# EAGLE design Music Shield (EAGLE 5.10)
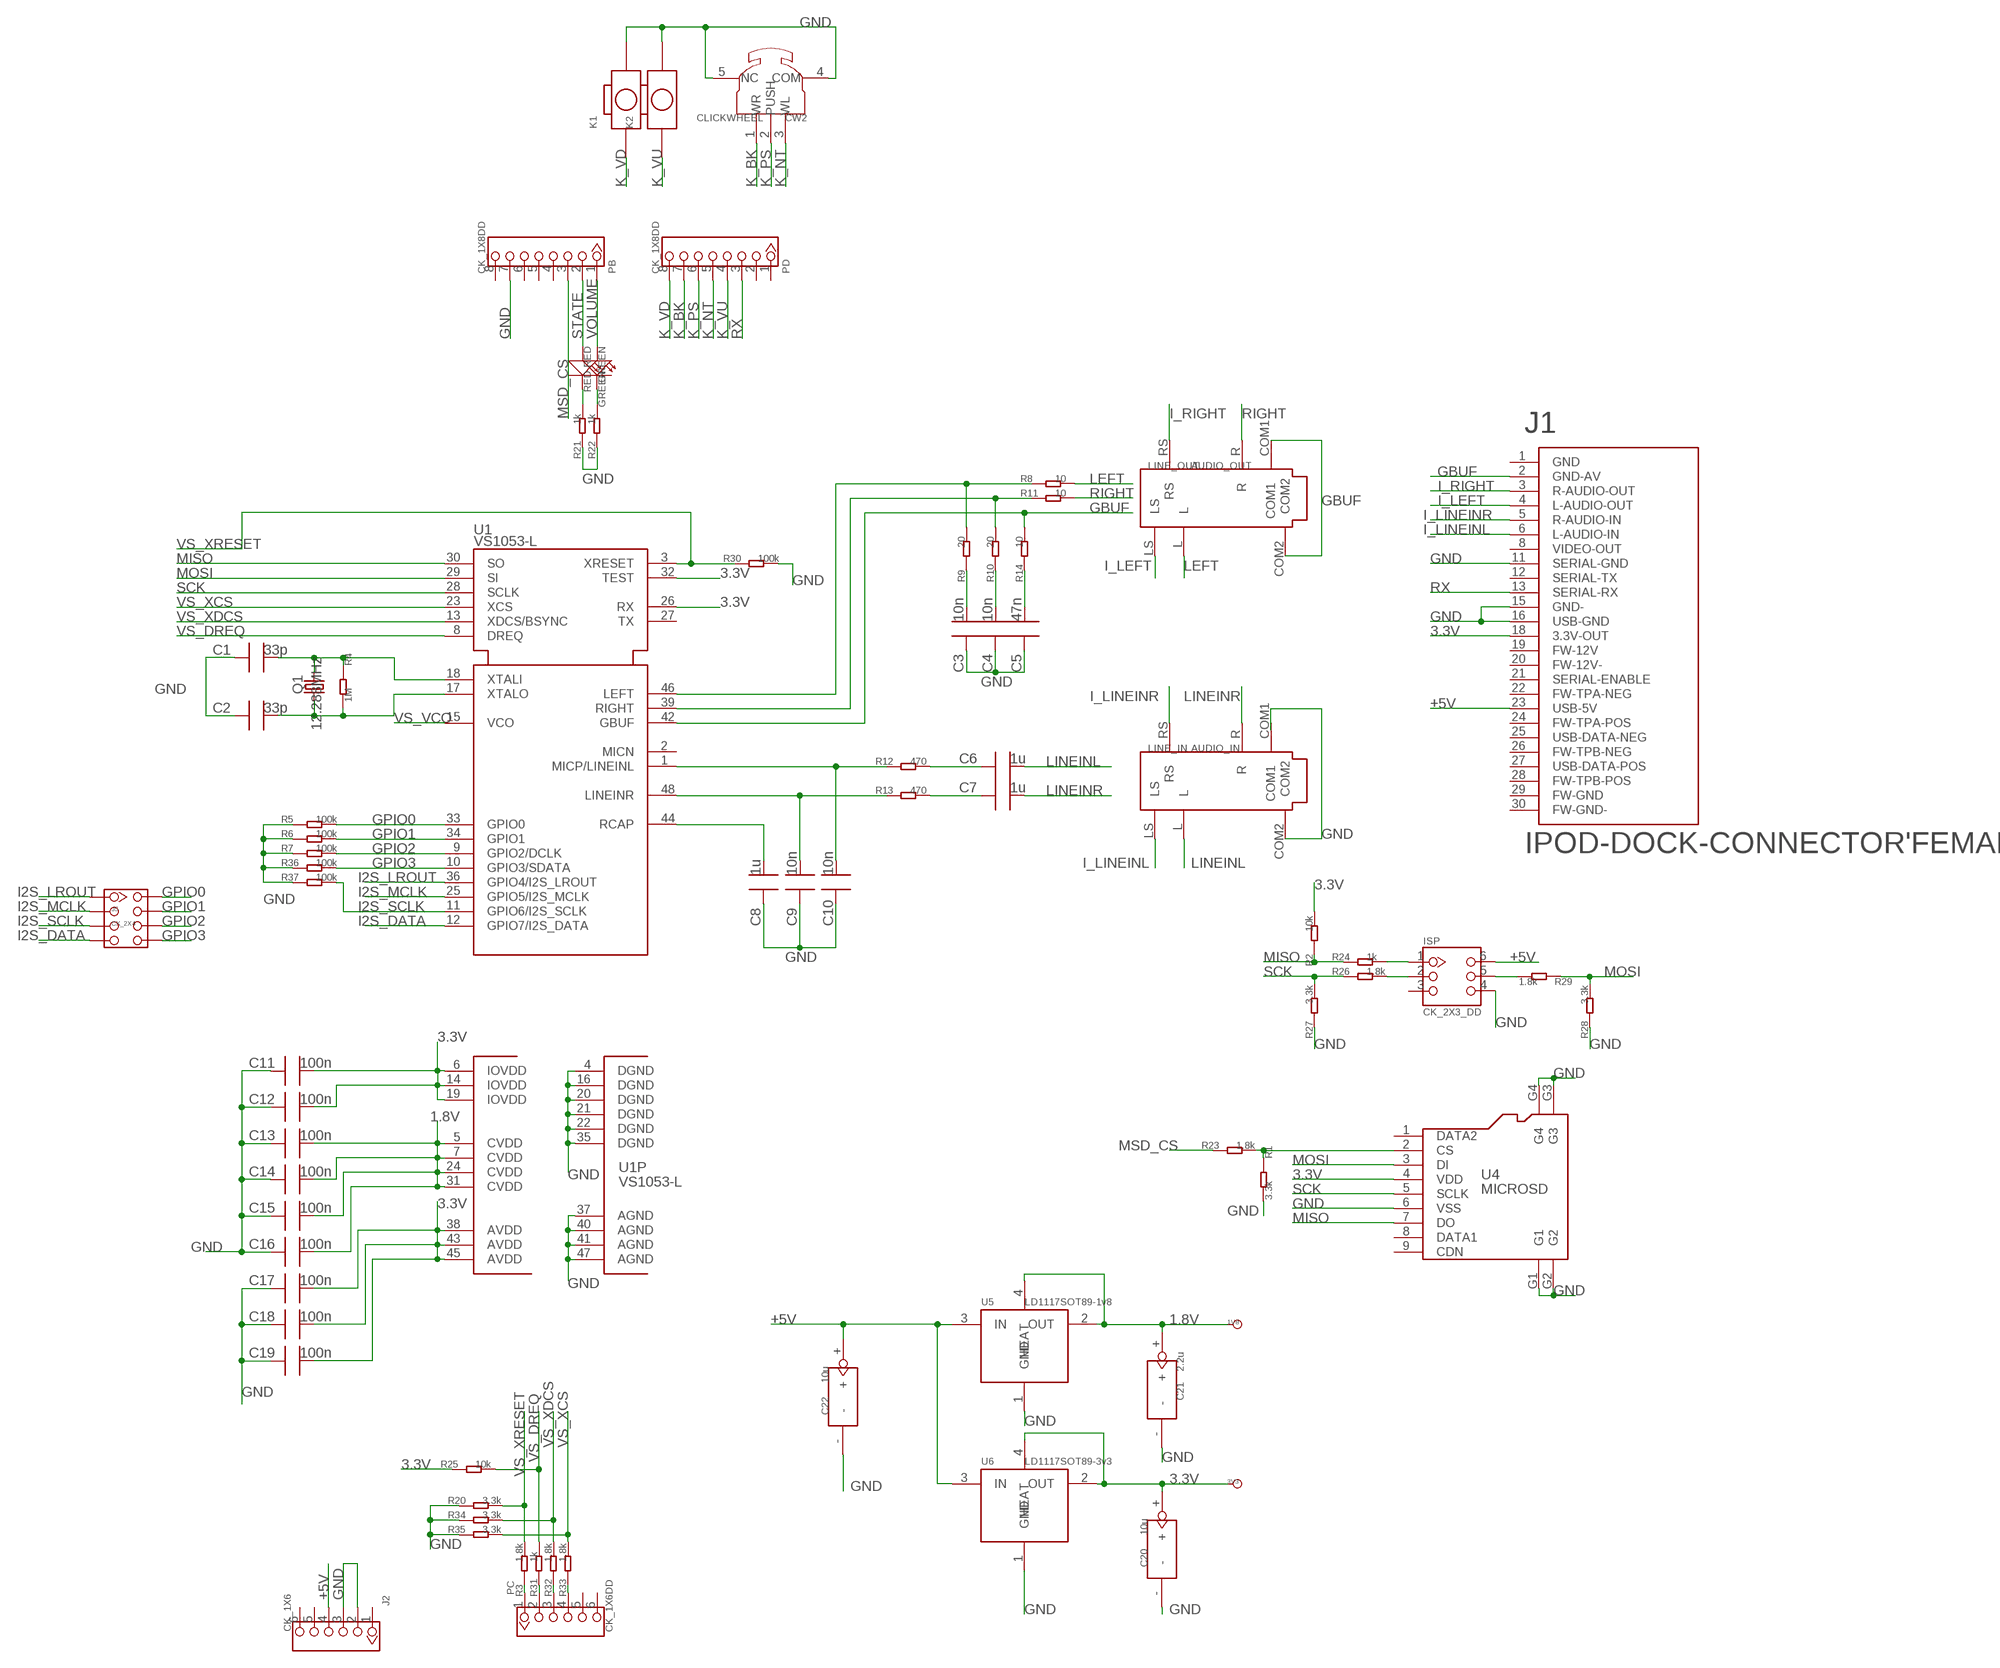
[diagram p0: schematic, sheet 1]

## Parts
1V8  TEST_POINT_SIZE_3030  [TP_3535]
3V3  TEST_POINT_SIZE_3030  [TP_3535]
C1  33p  C0603  [0603]
C2  33p  C0603  [0603]
C3  10n  C0603  [0603]
C4  10n  C0603  [0603]
C5  47n  C0603  [0603]
C6  1u  C0603  [0603]
C7  1u  C0603  [0603]
C8  1u  C0603  [0603]
C9  10n  C0603  [0603]
C10  10n  C0603  [0603]
C11  100n  C0603  [0603]
C12  100n  C0603  [0603]
C13  100n  C0603  [0603]
C14  100n  C0603  [0603]
C15  100n  C0603  [0603]
C16  100n  C0603  [0603]
C17  100n  C0603  [0603]
C18  100n  C0603  [0603]
C19  100n  C0603  [0603]
C20  10u  C_TAN_3X3.5  [C_TAN_3X3.5]
C21  2.2u  C_TAN_3X3.5  [C_TAN_3X3.5]
C22  10u  C_TAN_3X3.5  [C_TAN_3X3.5]
CW2  CLICKWHEEL  [CLICKWHEEL]
GREEN  GREEN  LED0603_DD  [LED0603]
ISP  CK_2X3_DD  [CK_2X3]
J1  IPOD-DOCK-CONNECTOR'FEMALE'  [IPOD_FEMALE_CONNECTOR]
J2  CK_1X6  [CK_1X6]
J5  CK_2X4  [CK_2X4]
K1  BOTTON_1_DP  [BTN_5.0_RST]
K2  BOTTON_1_DP  [BTN_5.0_RST]
LINE_IN  AUDIO_IN  AUDIO-SMD-6P  [6P-SMD-3.5]
LINE_OUT  AUDIO_OUT  AUDIO-SMD-6P  [6P-SMD-3.5]
PB  CK_1X8DD  [CK_1X8]
PC  CK_1X6DD  CK_1X6  [CK_1X6]
PD  CK_1X8DD  [CK_1X8]
Q1  12.288MHz  CRYSTALHC49UP  [HC49UP]
R1  3.3k  R0603  [0603]
R2  10k  R0603  [0603]
R3  1.8k  R0603  [0603]
R4  1M  R0603  [0603]
R5  100k  R0603  [0603]
R6  100k  R0603  [0603]
R7  100k  R0603  [0603]
R8  10  R0603  [0603]
R9  20  R0603  [0603]
R10  20  R0603  [0603]
R11  10  R0603  [0603]
R12  470  R0603  [0603]
R13  470  R0603  [0603]
R14  10  R0603  [0603]
R20  3.3k  R0603  [0603]
R21  1k  R0603  [0603]
R22  1k  R0603  [0603]
R23  1.8k  R0603  [0603]
R24  1k  R0603  [0603]
R25  10k  R0603  [0603]
R26  1.8k  R0603  [0603]
R27  3.3k  R0603  [0603]
R28  3.3k  R0603  [0603]
R29  1.8k  R0603  [0603]
R30  100k  R0603  [0603]
R31  1k  R0603  [0603]
R32  1.8k  R0603  [0603]
R33  1.8k  R0603  [0603]
R34  3.3k  R0603  [0603]
R35  3.3k  R0603  [0603]
R36  100k  R0603  [0603]
R37  100k  R0603  [0603]
RED  RED  LED0603_DD  [LED0603]
U1  VS1053-L  [LQFP48]
U4  MICROSD  [MICROSD]
U5  LD1117SOT89-1v8  LD1117SOT89  [SOT89]
U6  LD1117SOT89-3v3  LD1117SOT89  [SOT89]

## Nets
1.8V: 1V8.T C13.2 C14.2 C15.2 C16.2 C21.+ U1.5(CVDD) U1.7(CVDD) U1.24(CVDD) U1.31(CVDD) U5.2(OUT) U5.4(HEAT)
3.3V: 3V3.T C11.2 C12.2 C17.2 C18.2 C19.2 C20.+ J1.18(3.3V-OUT) R2.2 R25.1 U1.6(IOVDD) U1.14(IOVDD) U1.19(IOVDD) U1.26(RX) U1.32(TEST) U1.38(AVDD) U1.43(AVDD) U1.45(AVDD) U4.4(VDD) U6.2(OUT) U6.4(HEAT)
+5V: C22.+ ISP.6 J1.23(USB-5V) J2.4 U5.3(IN) U6.3(IN)
GBUF: J1.2(GND-AV) LINE_OUT.COM1 LINE_OUT.COM2 R14.2 U1.42(GBUF)
GND: C1.1 C2.1 C3.1 C4.1 C5.1 C8.1 C9.1 C10.1 C11.1 C12.1 C13.1 C14.1 C15.1 C16.1 C17.1 C18.1 C19.1 C20.- C21.- C22.- CW2.4(COM) CW2.5(NC) ISP.4 J1.11(SERIAL-GND) J1.15(GND-) J1.16(USB-GND) J2.2 J2.3 K1.P$2 K2.P$2 LINE_IN.COM2 PB.7 R1.2 R5.1 R6.1 R7.1 R20.1 R21.1 R22.1 R27.1 R28.1 R30.2 R34.1 R35.1 R36.1 R37.1 U1.4(DGND) U1.16(DGND) U1.20(DGND) U1.21(DGND) U1.22(DGND) U1.35(DGND) U1.37(AGND) U1.40(AGND) U1.41(AGND) U1.47(AGND) U4.6(VSS) U4.G1 U4.G2 U4.G3 U4.G4 U5.1(GND) U6.1(GND)
GPIO0: J5.8 R5.2 U1.33(GPIO0)
GPIO1: J5.7 R6.2 U1.34(GPIO1)
GPIO2: J5.6 R7.2 U1.9(GPIO2/DCLK)
GPIO3: J5.5 R36.2 U1.10(GPIO3/SDATA)
I2S_DATA: J5.4 U1.12(GPIO7/I2S_DATA)
I2S_LROUT: J5.1 U1.36(GPIO4/I2S_LROUT)
I2S_MCLK: J5.2 U1.25(GPIO5/I2S_MCLK)
I2S_SCLK: J5.3 R37.2 U1.11(GPIO6/I2S_SCLK)
I_LEFT: J1.4(L-AUDIO-OUT) LINE_OUT.LS
I_LINEINL: J1.6(L-AUDIO-IN) LINE_IN.LS
I_LINEINR: J1.5(R-AUDIO-IN) LINE_IN.RS
I_RIGHT: J1.3(R-AUDIO-OUT) LINE_OUT.RS
K_BK: CW2.1(WR) PD.7
K_NT: CW2.3(WL) PD.5
K_PS: CW2.2(PUSH) PD.6
K_VD: K1.P$1 PD.8
K_VU: K2.P$1 PD.4
LEFT: LINE_OUT.L R8.2
LINEINL: C6.2 LINE_IN.L
LINEINR: C7.2 LINE_IN.R
MISO: R2.1 R24.1 U1.30(SO) U4.7(DO)
MOSI: R28.2 R29.1 U1.29(SI) U4.3(DI)
MSD_CS: PB.3 R23.1
N$1: C1.2 Q1.2 R4.1 U1.18(XTALI)
N$2: C2.2 Q1.1 R4.2 U1.17(XTALO)
N$3: R21.2 RED.2(-)
N$4: GREEN.2(-) R22.2
N$5: R8.1 R9.2 U1.46(LEFT)
N$6: R10.2 R11.1 U1.39(RIGHT)
N$7: C10.2 R12.1 U1.1(MICP/LINEINL)
N$8: C3.2 R9.1
N$9: C4.2 R10.1
N$10: C5.2 R14.1
N$11: C9.2 R13.1 U1.48(LINEINR)
N$12: C8.2 U1.44(RCAP)
N$13: ISP.2 R26.2
N$14: C6.1 R12.2
N$15: C7.1 R13.2
N$16: ISP.1 R24.2
N$18: PC.1 R3.1
N$19: PC.2 R31.1
N$20: ISP.5 R29.2
N$21: R1.1 R23.2 U4.2(CS)
N$24: PC.3 R32.1
N$25: PC.4 R33.1
RIGHT: LINE_OUT.R R11.2
RX: J1.13(SERIAL-RX) PD.3
SCK: R26.1 R27.2 U1.28(SCLK) U4.5(SCLK)
STATE: PB.2 RED.1(+)
VOLUME: GREEN.1(+) PB.1
VS_DREQ: R25.2 R31.2 U1.8(DREQ)
VS_VCO: U1.15(VCO)
VS_XCS: R33.2 R35.2 U1.23(XCS)
VS_XDCS: R32.2 R34.2 U1.13(XDCS/BSYNC)
VS_XRESET: R3.2 R20.2 R30.1 U1.3(XRESET)
Unconnected: ISP.3 J1.1(GND) J1.8(VIDEO-OUT) J1.12(SERIAL-TX) J1.19(FW-12V) J1.20(FW-12V-) J1.21(SERIAL-ENABLE) J1.22(FW-TPA-NEG) J1.24(FW-TPA-POS) J1.25(USB-DATA-NEG) J1.26(FW-TPB-NEG) J1.27(USB-DATA-POS) J1.28(FW-TPB-POS) J1.29(FW-GND) J1.30(FW-GND-) J2.1 J2.5 J2.6 LINE_IN.COM1 PB.4 PB.5 PB.6 PB.8 PC.5 PC.6 PD.1 PD.2 U1.2(MICN) U1.27(TX) U4.1(DATA2) U4.8(DATA1) U4.9(CDN)

## Library data of the parts
1V8 3V3 = For_Test_Albert:TEST_POINT
C1-C19 = CPT_SMD:C0603; C0603: 100N
C20-C22 = CPT_SMD:C_TAN
CW2 = MusicShield:CLICKWHEEL
GREEN RED = CPT_SMD:LED0603
ISP = CONNECTER:CK_2X3
J1 = CONNECTER:IPOD-DOCK-CONNECTOR
J2 PC = CONNECTER:CK_1X6
J5 = CONNECTER:CK_2X4
K1 K2 = CPT_SMD:BOTTON_1
LINE_IN LINE_OUT = Connector:AUDIO-SMD-6P
PB PD = CONNECTER:CK_1X8
Q1 = crystal:CRYSTAL: CRYSTAL
R1-R14 R20-R37 = CPT_SMD:R0603
U1 = vlsi:VS1053
U4 = CONNECTER:MICROSD
U5 U6 = ICs_v54:LD1117

## Net classes
0 default: width 0.152 mm, drill 0.305 mm, clearance 0.152 mm

## Board
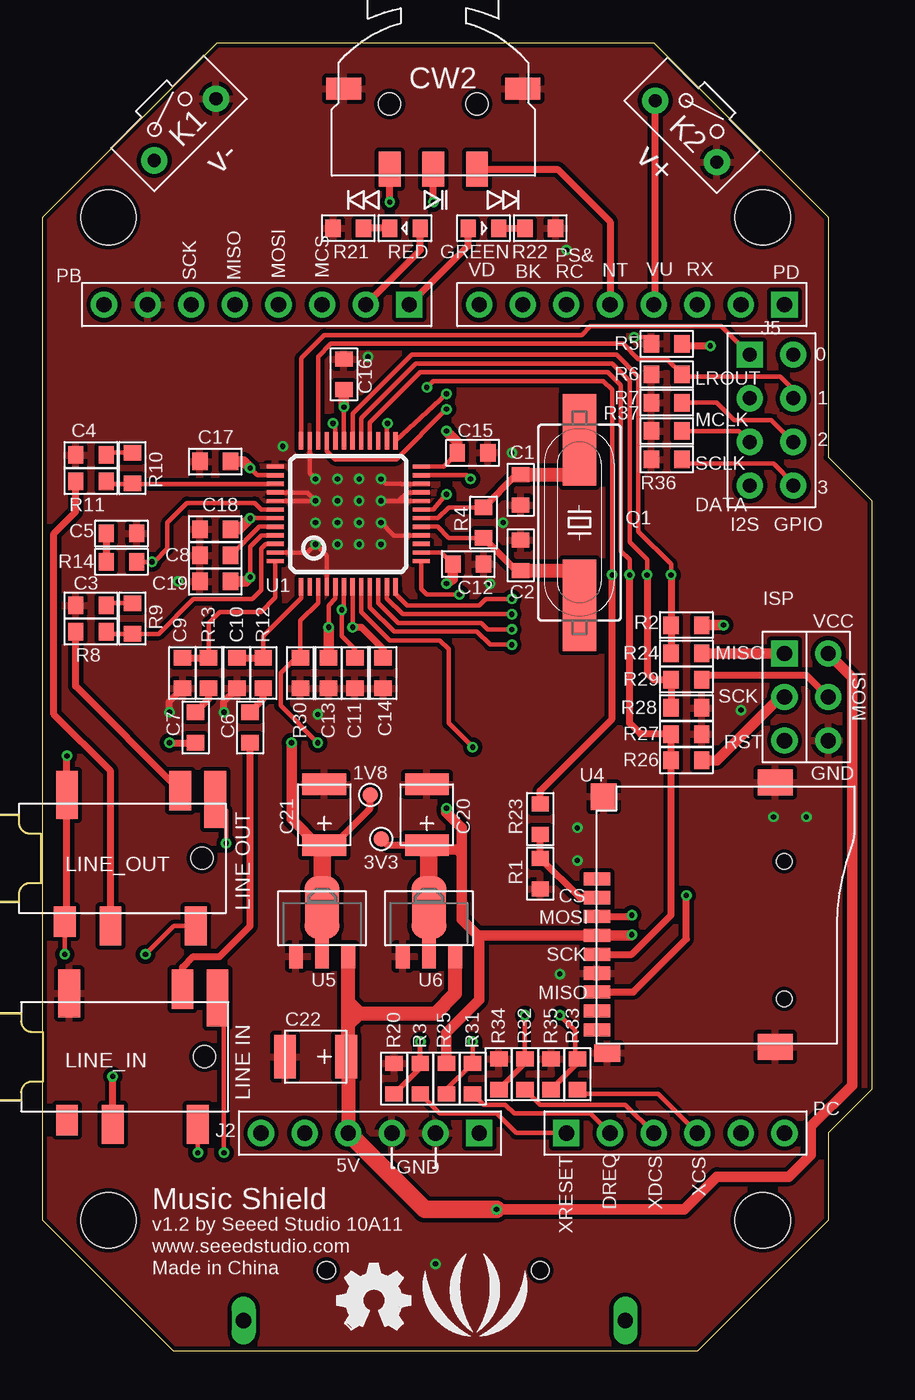
[diagram p1: board, top side]
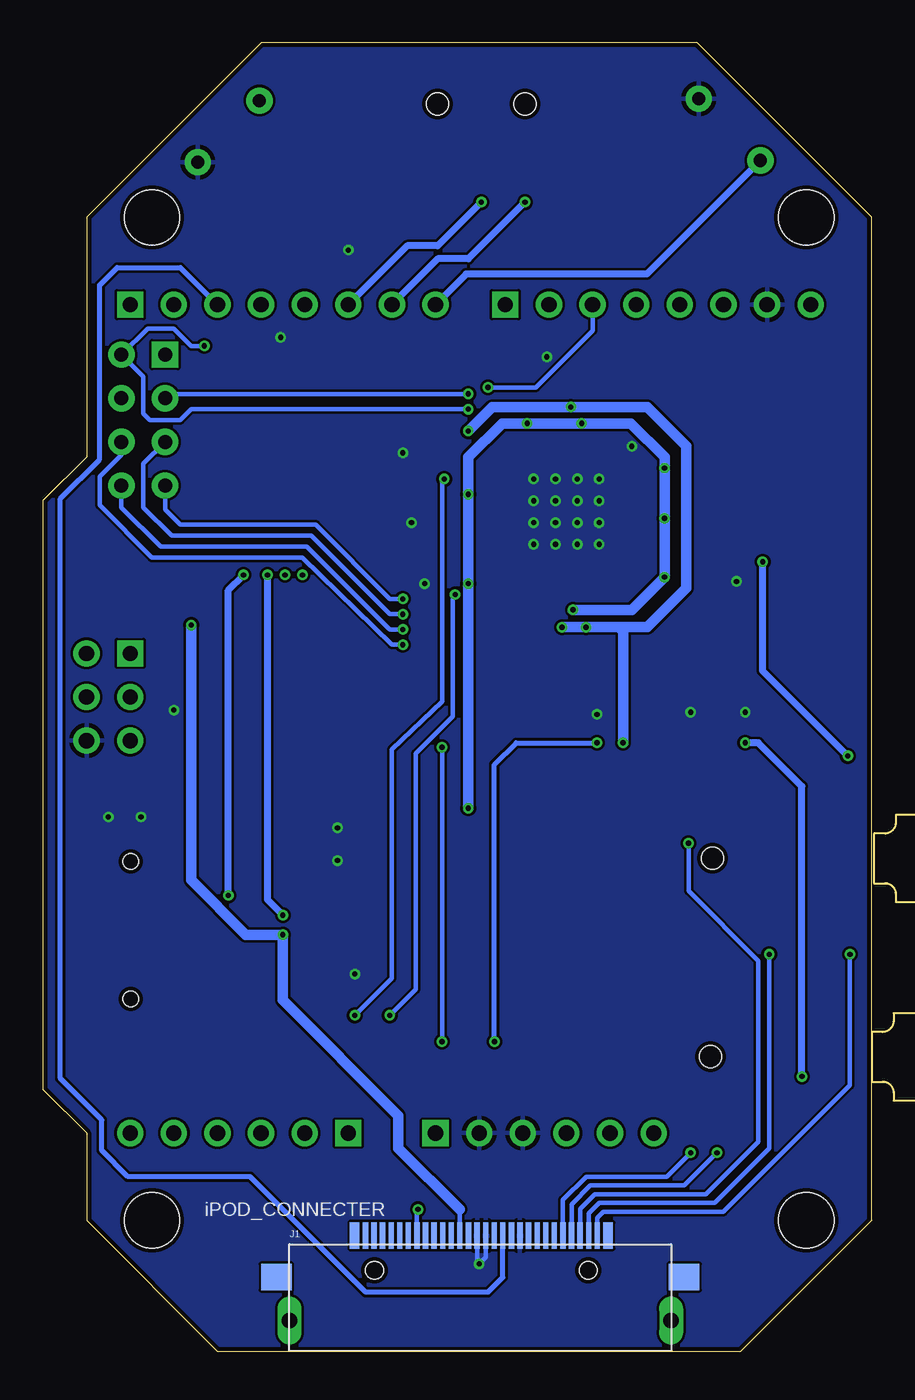
[diagram p2: board, bottom side, seen from below]

Size 48.26 x 76.2 mm. Coordinates in mm from the lower left corner, seen from the top.
Outline: 45.72,66.04 45.72,52.07 48.26,49.53 48.26,15.24 45.72,12.7 45.72,7.62 38.1,0 7.62,0 0,7.62 0,66.04 10.16,76.2 35.56,76.2 45.72,66.04
Copper layers (1*16): Top 0.035mm / dielectric 1.5mm / Bottom 0.035mm
Design rules "SeeedStudio_rule_no_angle_090911": minimum track width 6mil, minimum drill 12mil, track to track 6mil, track to pad 6mil, pad to pad 6mil, via to via 6mil, smd to smd 0mil, copper to edge 10mil, drill to drill 10mil, minimum pad ring 10mil, minimum via ring 6mil, stop-mask expansion 2mil, vias tented up to drill 100mil, thermal gap 10mil
Holes 3.2 mm at 41.91,66.04 3.81,66.04 41.91,7.62 3.81,7.62
tRestrict: area 13.2,49.7 to 13.8,49.8; area 21.7,50.2 to 22.4,50.3; area 21.7,49.7 to 22.4,49.8
bRestrict: area 22.7,6.5 to 22.8,6.9; area 20.1,7.5 to 20.8,7.6; area 22.2,7.5 to 23.2,7.6

### Footprints (pad centres in the part's own frame; a part is rotated, then mirrored left to right if it is on the bottom)
TP_3535 = smd 0.889 x 0.889: T 0,0
0603 = smd 0.889 x 1.016: 1 -0.889,0; 2 0.889,0
C_TAN_3X3.5 = smd 2.54 x 1.27: + 0,1.778; - 0,-1.778
CLICKWHEEL = smd 1.27 x 2.032: 1 2.54,-0.381; 2 0,-0.381; 3 -2.54,-0.381 | smd 2.032 x 1.27: 4 -5.207,-5.08; 5 5.207,-5.08 | hole 1.27: -2.54,-4.191; 2.54,-4.191
LED0603 = smd 0.889 x 1.016: 1 -0.889,0; 2 0.889,0
CK_2X3 = drill 0.889 pad 1.524 square: 1 -1.27,2.54 | drill 0.889 pad 1.524 round: 2 -1.27,0; 3 -1.27,-2.54; 4 1.27,-2.54; 5 1.27,0; 6 1.27,2.54
IPOD_FEMALE_CONNECTOR = smd 1.524 x 0.559: 1 -0.508,7.377; 30 -0.508,-7.377 | smd 1.524 x 0.305: 2 -0.508,6.75; 3 -0.508,6.25; 4 -0.508,5.75; 5 -0.508,5.25; 6 -0.508,4.75; 7 -0.508,4.25; 8 -0.508,3.75; 9 -0.508,3.25; 10 -0.508,2.75; 11 -0.508,2.25; 12 -0.508,1.75; 13 -0.508,1.25; 14 -0.508,0.75; 15 -0.508,0.25; 16 -0.508,-0.25; 17 -0.508,-0.75; 18 -0.508,-1.25; 19 -0.508,-1.75; 20 -0.508,-2.25; 21 -0.508,-2.75; 22 -0.508,-3.25; 23 -0.508,-3.75; 24 -0.508,-4.25; 25 -0.508,-4.75; 26 -0.508,-5.25; 27 -0.508,-5.75; 28 -0.508,-6.25; 29 -0.508,-6.75 | smd 1.524 x 1.778: S1 1.905,11.811; S2 1.905,-11.938 | drill 0.889 long: S3 4.445,-11.176; S4 4.445,11.049 | hole 1.016: 1.524,6.223; 1.524,-6.223
CK_1X6 = drill 0.889 pad 1.524 square: 1 0,6.35 | drill 0.889 pad 1.524 round: 2 0,3.81; 3 0,1.27; 4 0,-1.27; 5 0,-3.81; 6 0,-6.35
CK_2X4 = drill 0.813 pad 1.524 square: 1 -1.27,3.81 | drill 0.813 pad 1.524 round: 2 -1.27,1.27; 3 -1.27,-1.27; 4 -1.27,-3.81; 5 1.27,-3.81; 6 1.27,-1.27; 7 1.27,1.27; 8 1.27,3.81
BTN_5.0_RST = drill 0.762 pad 1.524 round: P$1 0,2.54; P$2 0,-2.54
6P-SMD-3.5 = smd 1.27 x 1.778: COM1 -4.572,3.683 | smd 1.27 x 2.794: COM2 -4.699,-3.683 | smd 1.27 x 2.286: L -11.303,-3.937; R -7.239,3.937; RS -12.192,3.937 | smd 1.27 x 3.302: LS -13.335,-3.429 | hole 1.27: -12.573,0
CK_1X8@1 = drill 0.889 pad 1.524 square: 1 0,8.89 | drill 0.889 pad 1.524 round: 2 0,6.35; 3 0,3.81; 4 0,1.27; 5 0,-1.27; 6 0,-3.81; 7 0,-6.35; 8 0,-8.89
HC49UP = smd 5.334 x 1.93: 1 -4.826,0; 2 4.826,0
LQFP48 = smd 0.25 x 1: 1 -2.75,-4.25; 2 -2.25,-4.25; 3 -1.75,-4.25; 4 -1.25,-4.25; 5 -0.75,-4.25; 6 -0.25,-4.25; 7 0.25,-4.25; 8 0.75,-4.25; 9 1.25,-4.25; 10 1.75,-4.25; 11 2.25,-4.25; 12 2.75,-4.25; 25 2.75,4.25; 26 2.25,4.25; 27 1.75,4.25; 28 1.25,4.25; 29 0.75,4.25; 30 0.25,4.25; 31 -0.25,4.25; 32 -0.75,4.25; 33 -1.25,4.25; 34 -1.75,4.25; 35 -2.25,4.25; 36 -2.75,4.25 | smd 1 x 0.25: 13 4.25,-2.75; 14 4.25,-2.25; 15 4.25,-1.75; 16 4.25,-1.25; 17 4.25,-0.75; 18 4.25,-0.25; 19 4.25,0.25; 20 4.25,0.75; 21 4.25,1.25; 22 4.25,1.75; 23 4.25,2.25; 24 4.25,2.75; 37 -4.25,2.75; 38 -4.25,2.25; 39 -4.25,1.75; 40 -4.25,1.25; 41 -4.25,0.75; 42 -4.25,0.25; 43 -4.25,-0.25; 44 -4.25,-0.75; 45 -4.25,-1.25; 46 -4.25,-1.75; 47 -4.25,-2.25; 48 -4.25,-2.75
MICROSD = smd 1.524 x 0.762: 1 0,4.4; 2 0,3.3; 3 0,2.2; 4 0,1.1; 5 0,0; 6 0,-1.1; 7 0,-2.2; 8 0,-3.3; 9 0,-4.4 | smd 1.524 x 1.016: G1 0.6,-5.746 | smd 2.032 x 1.524: G2 10.373,-5.4; G3 10.373,10 | smd 1.524 x 1.524: G4 0.392,9.181 | hole 0.889: 10.9,-2.6; 10.9,5.4
SOT89 = smd 0.8 x 1.4: 1 -1.524,-1.905; 3 1.524,-1.905 | smd 0.8 x 1.9: 2 0,-1.651 | smd 2.032 x 3.65: 4 0,0.94

### Placement (x,y rotation side)
1V8  19.05,32.39 90 top
3V3  19.68,29.84 0 top
C1  27.81,50.17 90 top
C2  27.81,46.36 270 top
C3  2.79,43.43 0 top
C4  2.79,52.2 0 top
C5  4.57,47.62 180 top
C6  12.06,36.32 270 top
C7  8.89,36.32 270 top
C8  10.03,46.36 0 top
C9  8.13,39.5 90 top
C10  11.3,39.5 90 top
C11  18.16,39.5 90 top
C12  24.77,45.85 180 top
C13  16.64,39.5 90 top
C14  19.81,39.5 90 top
C15  25.02,52.32 180 top
C16  17.53,56.9 270 top
C17  10.03,51.82 0 top
C18  10.03,47.88 0 top
C19  10.03,44.83 0 top
C20  22.35,31.24 180 top
C21  16.38,31.24 180 top
C22  15.88,17.14 270 top
CW2  22.73,68.45 180 top
GREEN  25.65,65.41 0 top
ISP  44.45,38.1 0 top
J1  22.73,6.22 270 bottom
J2  19.05,12.7 270 top
J5  42.42,54.23 0 top
K1  8.28,71.15 135 top
K2  37.45,71.04 45 top
LINE_IN  -3.17,17.14 180 top
LINE_OUT  -3.3,28.7 180 top
PB  CK_1X8DD  [CK_1X8@1]  12.45,60.96 270 top
PC  36.83,12.7 90 top
PD  CK_1X8DD  [CK_1X8@1]  34.29,60.96 270 top
Q1  31.24,48.26 90 top
R1  28.96,27.81 270 top
R2  37.47,42.29 0 top
R3  21.97,15.88 90 top
R4  25.65,48.26 270 top
R5  36.32,58.67 0 top
R6  36.32,56.9 0 top
R7  36.32,55.25 0 top
R8  2.79,41.91 180 top
R9  5.21,42.67 270 top
R10  5.21,51.44 270 top
R11  2.79,50.67 180 top
R12  12.83,39.5 270 top
R13  9.65,39.5 270 top
R14  4.57,45.97 0 top
R20  20.45,15.88 270 top
R21  17.78,65.41 0 top
R22  28.96,65.41 180 top
R23  28.96,30.99 270 top
R24  37.47,40.64 0 top
R25  23.5,15.88 270 top
R26  37.47,34.42 0 top
R27  37.47,35.94 180 top
R28  37.47,37.47 180 top
R29  37.47,39.12 0 top
R30  14.99,39.5 270 top
R31  25.02,15.88 90 top
R32  28.07,16.13 90 top
R33  31.11,16.13 90 top
R34  26.54,16.13 270 top
R35  29.59,16.13 270 top
R36  36.32,51.94 0 top
R37  36.32,53.59 0 top
RED  21.08,65.41 180 top
U1  17.78,48.77 0 top
U4  32.26,23.11 0 top
U5  16.26,24.89 0 top
U6  22.48,24.89 0 top
U$1  [LOGO_SILK]  25.15,2.54 0 top
U$3  [OSHW_FILLX150_NOTEXT]  17.14,1.27 0 top

### Tracks (layer width: path | path; a pad name or v marks a point on that pad's centre or on a via)
1.8V  (via drill 0.3)
  Top 0.254: v17.53,54.99 U1.31 | U1.5 17.03,43.83 16.64,43.43 v16.64,42.16 | U1.7 18.03,43.18 18.03,42.93 v18.03,42.16 | U1.24 23.32,51.52 C15.2
  Top 0.406: v18.03,42.16 18.54,42.16 19.81,40.89 C14.2 | 1V8.T 19.05,31.62 16.89,29.46 C21.+
  Top 0.61: v16.64,42.16 C13.2 | C15.2 24.13,52.96 v23.5,53.59 | 16,29.46 14.48,30.99 v14.48,35.43 | C16.2 v17.53,54.99
  Top 0.813: U5.2 U5.4
  Top 1.016: U5.4 16.26,29.34 | 16.26,29.34 C21.+ | 16.26,29.34 16.13,29.34 16,29.46
  Bottom 0.61: v23.5,53.59 22.1,54.99 v17.53,54.99 13.08,54.99 10.79,52.7 10.79,44.45 13.08,42.16 14.73,42.16 | 14.73,42.16 v16.64,42.16 v18.03,42.16 | v14.48,35.43 14.48,41.91 14.73,42.16
3.3V  (via drill 0.3)
  Top 0.254: U1.26 20.03,54 v20.07,54.04 | U1.38 12.48,51.02 v12.06,51.44 | U1.43 12.44,48.52 v12.06,48.51 | U1.32 17.03,53.9 v16.89,54.04 | U1.45 12.72,47.52 12.06,46.86 v12.06,45.08 | U1.19 22.73,49.02 v23.5,49.91 | U1.14 23.2,46.52 C12.2 | U1.6 17.53,43.44 v17.4,43.18 17.4,41.66 18.16,40.89 C11.2
  Top 0.406: C20.+ 20.07,29.46 3V3.T
  Top 0.61: C19.2 11.81,44.83 v12.06,45.08 | C18.2 11.43,47.88 v12.06,48.51 | C17.2 11.68,51.82 v12.06,51.44 | C12.2 23.88,44.96 v23.5,44.7 | v39.62,42.29 R2.2 | v34.29,24.26 34.25,24.21 U4.4 25.48,24.21 25.4,24.13 | 22.48,29.21 24.13,29.21 24.38,28.96 | R25.1 23.5,18.54 25.4,20.45 25.4,24.13 | 25.4,24.13 24.38,25.15 24.38,28.96 | v23.5,31.62 23.5,31.37 24.38,30.48 24.38,28.96
  Top 0.813: U6.4 U6.2
  Top 1.016: U6.4 22.48,29.21 22.48,29.34 C20.+
  Bottom 0.254: J1.18 23.98,8.23 24,8.26
  Bottom 0.61: v17.4,43.18 13.97,43.18 v12.06,45.08 v12.06,48.51 v12.06,51.44 12.06,52.07 14.04,54.04 v16.89,54.04 v20.07,54.04 21.52,54.04 23.5,52.07 v23.5,49.91 v23.5,44.7 v23.5,31.62 | v39.62,42.29 39.62,27.43 36.45,24.26 v34.29,24.26 34.29,20.45 27.56,13.72 27.56,11.81 24,8.26
+5V  (via drill 0.3)
  Top 0.61: ISP.6 47.12,39.24 47.12,15.49 44.7,13.08 44.7,11.43 43.43,10.16 39.24,10.16 37.34,8.26 v26.42,8.26
  Top 0.813: J2.4 17.78,17.02 C22.+ 17.78,17.27 17.78,19.05 | 17.78,19.05 17.78,20.32 | 17.78,20.32 U5.3 | U6.3 24,20.83 22.86,19.69 18.41,19.69 | 17.78,20.32 18.41,19.69 | 17.78,19.05 18.41,19.69
  Top 1.016: v26.42,8.26 22.23,8.26 J2.4
  Bottom 0.254: J1.23 26.48,8.19 v26.42,8.26
GBUF  (via drill 0.3)
  Top 0.254: v6.35,45.97 R14.2 v6.35,45.97 | v6.35,45.97 6.48,45.97 7.24,46.74 7.24,48.26 8.38,49.4 12.32,49.4 12.7,49.02 U1.42 | v1.27,23.11 LINE_OUT.COM1
  Top 0.406: v1.4,34.67 LINE_OUT.COM2 1.4,25.15 LINE_OUT.COM1
  Bottom 0.254: J1.2 15.98,7.77 15.62,8.13 8.64,8.13 1.27,15.49 v1.27,23.11
  Bottom 0.406: v6.35,45.97 6.35,39.62 v1.4,34.67
GND  (via drill 0.3)
  Top 0.254: U1.47 15.4,46.52 v15.88,46.99 16.53,46.33 U1.4 | 20.7,49.52 19.7,49.52 v19.68,49.53 | 20.7,49.52 U1.20 | U1.21 21.2,50.02 20.7,49.52 | U1.22 20.86,50.52 20.83,50.55 19.94,50.55 v19.68,50.8 | U1.16 20.43,47.52 v19.68,48.26 | U1.41 15.86,49.52 v15.88,49.53 15.39,50.02 U1.40 | U1.35 15.53,51.14 v15.88,50.8 | v34.42,59.06 35.05,59.06 R5.1
  Top 0.406: v7.37,37.21 7.37,37.85 C9.1 | v10.54,37.21 10.54,37.85 C10.1
  Bottom 0.254: J1.15 22.48,5.46 v22.86,5.08 22.98,5.2 J1.16
  other vias: 13.97,52.7 17.14,50.8 18.41,50.8 19.68,46.99 18.41,46.99 17.14,46.99 15.88,48.26 17.14,49.53 18.41,49.53 18.41,48.26 17.14,48.26 44.45,31.11 30.1,21.97 7.87,44.83 26.04,44.7 26.8,48.26 27.3,52.32 18.92,57.91 40.64,37.34 16,37.08 30.48,64.14 31.11,30.48 31.11,28.57 42.55,31.11
  pour Top: -8.89,60.96 -6.35,60.96 -6.35,58.42 -8.89,58.42
  pour Top (isolate 0.254): 0,66.04 10.16,76.2 35.56,76.2 45.72,66.04 45.72,52.07 48.26,49.53 48.26,15.24 45.72,12.7 45.72,7.62 38.1,0 7.62,0 0,7.62
  pour Bottom: 0,66.04 10.16,76.2 35.56,76.2 45.72,66.04 45.72,52.07 48.26,49.53 48.39,15.24 45.72,12.7 45.72,7.62 38.1,0 7.62,0 0,7.62
GPIO0  (via drill 0.3)
  Top 0.254: U1.33 16.53,52.43 17.02,51.94 20.57,51.94 v23.5,54.86
  Top 0.406: v38.86,58.55 37.21,58.55 R5.2
  Bottom 0.254: v23.5,54.86 39.62,54.86 40.26,54.23 42.04,54.23 42.42,54.61 42.42,56.77 J5.8 42.16,59.56 40.64,59.56 39.62,58.55 v38.86,58.55
GPIO1
  Top 0.254: U1.34 16.03,57.94 16.76,58.67 33.78,58.67 34.67,57.78 36.32,57.78 R6.2 37.34,56.77 42.93,56.77 43.69,56.01 J5.7
GPIO2  (via drill 0.3)
  Top 0.254: U1.9 19.03,43.33 20.45,41.91 25.27,41.91 26.04,41.15 v27.3,41.15 | R7.2 39.24,55.25 40.26,54.23 42.42,54.23 J5.6
  Bottom 0.254: v27.3,41.15 27.94,41.15 33.15,46.23 41.91,46.23 44.96,49.28 44.96,50.93 43.69,52.2 J5.6
GPIO3  (via drill 0.3)
  Top 0.254: U1.10 19.53,43.59 20.7,42.42 25.53,42.42 25.91,42.04 v27.3,42.04 | J5.5 43.69,50.55 42.55,51.69 37.47,51.69 R36.2
  Bottom 0.254: v27.3,42.04 28.07,42.04 32.89,46.86 41.4,46.86 43.69,49.15 J5.5
I2S_DATA  (via drill 0.3)
  Top 0.254: U1.12 20.53,44.11 21.21,43.43 25.4,43.43 25.78,43.81 v27.3,43.81
  Bottom 0.254: v27.3,43.81 28.07,43.81 32.38,48.13 40.26,48.13 41.15,49.02 J5.4
I2S_LROUT
  Top 0.254: U1.36 15.03,57.83 16.38,59.18 31.37,59.18 31.88,59.69 39.5,59.69 J5.1
I2S_MCLK  (via drill 0.3)
  Top 0.254: U1.25 20.53,53.04 v23.5,55.75
  Bottom 0.254: v23.5,55.75 40.89,55.75 J5.2
I2S_SCLK  (via drill 0.3)
  Top 0.254: U1.11 20.03,43.85 20.95,42.93 v27.3,42.93 | R37.2 40.51,53.59 J5.3
  Bottom 0.254: v27.3,42.93 28.07,42.93 32.64,47.5 40.77,47.5 42.42,49.15 42.42,51.69 J5.3
I_LEFT  (via drill 0.3)
  Top 0.254: v10.67,29.59 10.67,31.5 LINE_OUT.LS
  Bottom 0.254: J1.4 16.98,8.29 16.13,9.14 9.65,9.14 6.6,12.19 6.6,22.73 10.67,26.8 v10.67,29.59
I_LINEINL  (via drill 0.3)
  Top 0.254: 10.41,20.32 LINE_IN.LS 10.54,20.19 v10.54,11.56
  Bottom 0.254: J1.6 17.98,8.81 16.64,10.16 11.94,10.16 v10.54,11.56
I_LINEINR  (via drill 0.3)
  Top 0.254: v9.02,11.56 LINE_IN.RS
  Bottom 0.254: J1.5 17.48,8.55 16.38,9.65 10.92,9.65 v9.02,11.56
I_RIGHT  (via drill 0.3)
  Top 0.254: v5.97,23.11 7.62,24.77 LINE_OUT.RS
  Bottom 0.254: J1.3 16.48,8.03 15.88,8.64 9.14,8.64 5.97,11.81 v5.97,23.11
K_BK  (via drill 0.3)
  Top 0.406: v20.19,66.93 CW2.1
  Bottom 0.406: PD.7 25.27,63.63 23.5,63.63 v20.19,66.93
K_NT
  Top 0.406: PD.5 33.02,65.79 29.97,68.83 CW2.3
K_PS  (via drill 0.3)
  Top 0.406: v22.73,66.93 CW2.2
  Bottom 0.406: PD.6 27.05,64.39 25.27,64.39 v22.73,66.93
K_VD
  Bottom 0.406: PD.8 23.62,62.74 13.1,62.74 K1.P$1
K_VU
  Top 0.406: K2.P$1 35.65,61.05 PD.4
LEFT
  Top 0.406: R8.2 1.91,38.73 LINE_OUT.L
LINEINL
  Top 0.406: C6.2 12.06,24.77 10.29,22.99 8.76,22.99 8.13,22.35 LINE_IN.L
LINEINR  (via drill 0.3)
  Top 0.406: v7.37,35.43 C7.2 | LINE_IN.R v4.06,16
  Bottom 0.406: v7.37,35.43 6.6,35.43 4.06,32.89 v4.06,16
MISO  (via drill 0.3)
  Top 0.254: U1.30 18.03,54.61 21.46,58.04 33.4,58.04 34.67,56.77 34.67,47.75 36.58,45.85 v36.58,45.21
  Top 0.406: R24.1 R2.1 v36.58,45.21 | U4.7 34.38,20.91 37.47,24 v37.47,26.54
  Bottom 0.406: v37.47,26.54 37.47,44.32 v36.58,45.21
MOSI  (via drill 0.3)
  Top 0.254: U1.29 18.53,54.34 21.72,57.53 33.15,57.53 34.16,56.52 34.16,47.12 35.18,46.1 v35.18,45.21
  Top 0.406: R28.2 R29.1 35.56,39.12 35.18,39.5 v35.18,45.21 | U4.3 34.2,25.31 v34.29,25.4
  Bottom 0.406: v34.29,25.4 35.18,26.29 v35.18,45.21
MSD_CS  (via drill 0.3)
  Top 0.254: v33.15,45.21 33.15,56.01 32.64,56.52 22.73,56.52 v22.35,56.13
  Top 0.406: v33.15,45.21 33.15,36.83 28.96,32.64 R23.1
  Bottom 0.254: v22.35,56.13 19.56,56.13 16.26,59.44 PB.3
N$1
  Top 0.254: R4.1 23.62,49.15 22.99,48.52 U1.18
  Top 0.305: 30.73,51.05 31.11,51.44 31.11,52.96 Q1.2
  Top 0.406: C1.2 27.56,51.05 R4.1
  Top 0.813: C1.2 30.73,51.05
N$2
  Top 0.254: R4.2 23.62,47.37 22.98,48.02 U1.17
  Top 0.406: C2.2 27.56,45.47 R4.2
  Top 0.813: C2.2 30.73,45.47 30.73,43.94 Q1.1
N$3
  Top 0.406: RED.2 R21.2
N$4
  Top 0.406: GREEN.2 R22.2
N$5
  Top 0.254: U1.46 12.98,47.02 12.7,46.74 12.7,44.32 12.19,43.81 8.76,43.81 6.73,41.78 R9.2 3.81,41.78 R8.1
N$6
  Top 0.254: 5.18,50.52 U1.39 | 5.18,50.52 R10.2 | 5.18,50.52 3.84,50.52 R11.1
N$7
  Top 0.254: U1.1 15.03,43.86 12.83,41.66 R12.1
  Top 0.406: C10.2 R12.1
N$8
  Top 0.254: R9.1 3.81,43.56 C3.2
N$9
  Top 0.254: R10.1 3.81,52.32 C4.2
N$10
  Top 0.406: C5.2 R14.1
N$11
  Top 0.254: U1.48 13.53,43.88 12.7,43.05 10.29,43.05 9.65,42.42 R13.1
  Top 0.406: C9.2 R13.1
N$12
  Top 0.254: U1.44 12.59,48.02 C8.2
N$13
  Top 0.61: ISP.2 42.93,38.1 39.24,34.42 R26.2
N$14
  Top 0.406: R12.2 12.83,37.97 C6.1
N$15
  Top 0.406: R13.2 9.65,37.97 C7.1
N$16
  Top 0.61: R24.2 ISP.1
N$18
  Top 0.254: PC.1 27.56,12.7 26.42,13.84 23.11,13.84 R3.1
N$19
  Top 0.254: PC.2 31.88,13.84 27.43,13.84 26.92,14.35 25.65,14.35 R31.1
N$20
  Top 0.406: ISP.5 44.45,39.37 38.61,39.37 R29.2
N$21
  Top 0.406: R23.2 R1.1 31.24,26.41 U4.2
N$24
  Top 0.254: PC.3 33.91,14.35 28.96,14.35 R32.1
N$25
  Top 0.254: PC.4 35.81,14.99 31.37,14.99 R33.1
RIGHT
  Top 0.406: R11.2 1.91,48.89 0.64,47.62 0.64,37.08 3.94,33.78 LINE_OUT.R
RX
  Bottom 0.305: J1.13 21.48,4.3 22.35,3.43 29.46,3.43 36.2,10.16 43.31,10.16 44.83,11.68 44.83,13.46 47.24,15.88 47.24,49.66 44.96,51.94 44.96,62.1 43.94,63.12 40.26,63.12 PD.3
SCK  (via drill 0.3)
  Top 0.254: U1.28 19.03,54.08 21.97,57.02 32.89,57.02 33.66,56.26 33.66,46.61 34.16,46.1 v34.16,45.21
  Top 0.406: v34.16,45.21 34.16,36.58 34.8,35.94 R27.2 R26.1 36.58,25.4 34.29,23.11 U4.5
STATE
  Top 0.406: PB.2 21.97,64.14 RED.1
VOLUME
  Top 0.406: PB.1 24.77,64.39 GREEN.1
VS_DREQ  (via drill 0.3)
  Top 0.254: R25.2 23.5,15.24 R31.2 v25.02,18.03 | U1.8 18.53,43.06 20.19,41.4 23.11,41.4 23.62,40.89 23.62,36.58 v25.02,35.18
  Bottom 0.254: v25.02,18.03 v25.02,35.18
VS_XCS  (via drill 0.3)
  Top 0.254: v30.1,19.56 30.99,18.67 30.99,17.14 R33.2 | U1.23 24.67,51.02 v24.89,50.8
  Top 0.305: R33.2 31.11,16.76 R35.2
  Bottom 0.254: v30.1,19.56 27.94,21.72 27.94,35.05 25.02,37.85 25.02,50.55 v24.89,50.8
VS_XDCS  (via drill 0.3)
  Top 0.254: R32.2 v28.07,19.56 | U1.13 22.03,44.39 22.35,44.07 v24.26,44.07
  Top 0.305: R32.2 28.07,16.76 R34.2
  Bottom 0.254: v28.07,19.56 26.54,21.08 26.54,34.8 24.38,36.96 24.38,43.81 24.26,43.94 v24.26,44.07
VS_XRESET  (via drill 0.3)
  Top 0.254: v16,35.43 13.84,37.59 13.84,39.5 14.73,40.39 R30.1 14.99,42.55 16.03,43.59 U1.3
  Top 0.305: v21.97,18.03 R3.2 21.97,16.51 R20.2
  Bottom 0.305: v21.97,18.03 21.97,34.16 20.7,35.43 v16,35.43

### Text on the board
tPlace: v+ | v- | PS& | SCK | MISO | MOSI | MCS | VD | BK | RC | NT | VU | RX | 0 | LROUT | 1 | MCLK | 2 | SCLK | 3 | DATA | I2S | GPIO | VCC | MISO | SCK | MOSI | RST | GND | CS | LINE OUT | MOSI | SCK | MISO | LINE IN | 5V | GND | XCS | Music Shield | DREQ | XDCS | v1.2 by Seeed Studio 10A11 | XRESET | www.seeedstudio.com | Made in China
bPlace: iPOD_CONNECTER